# EAGLE design stair light usb (EAGLE 6.2)
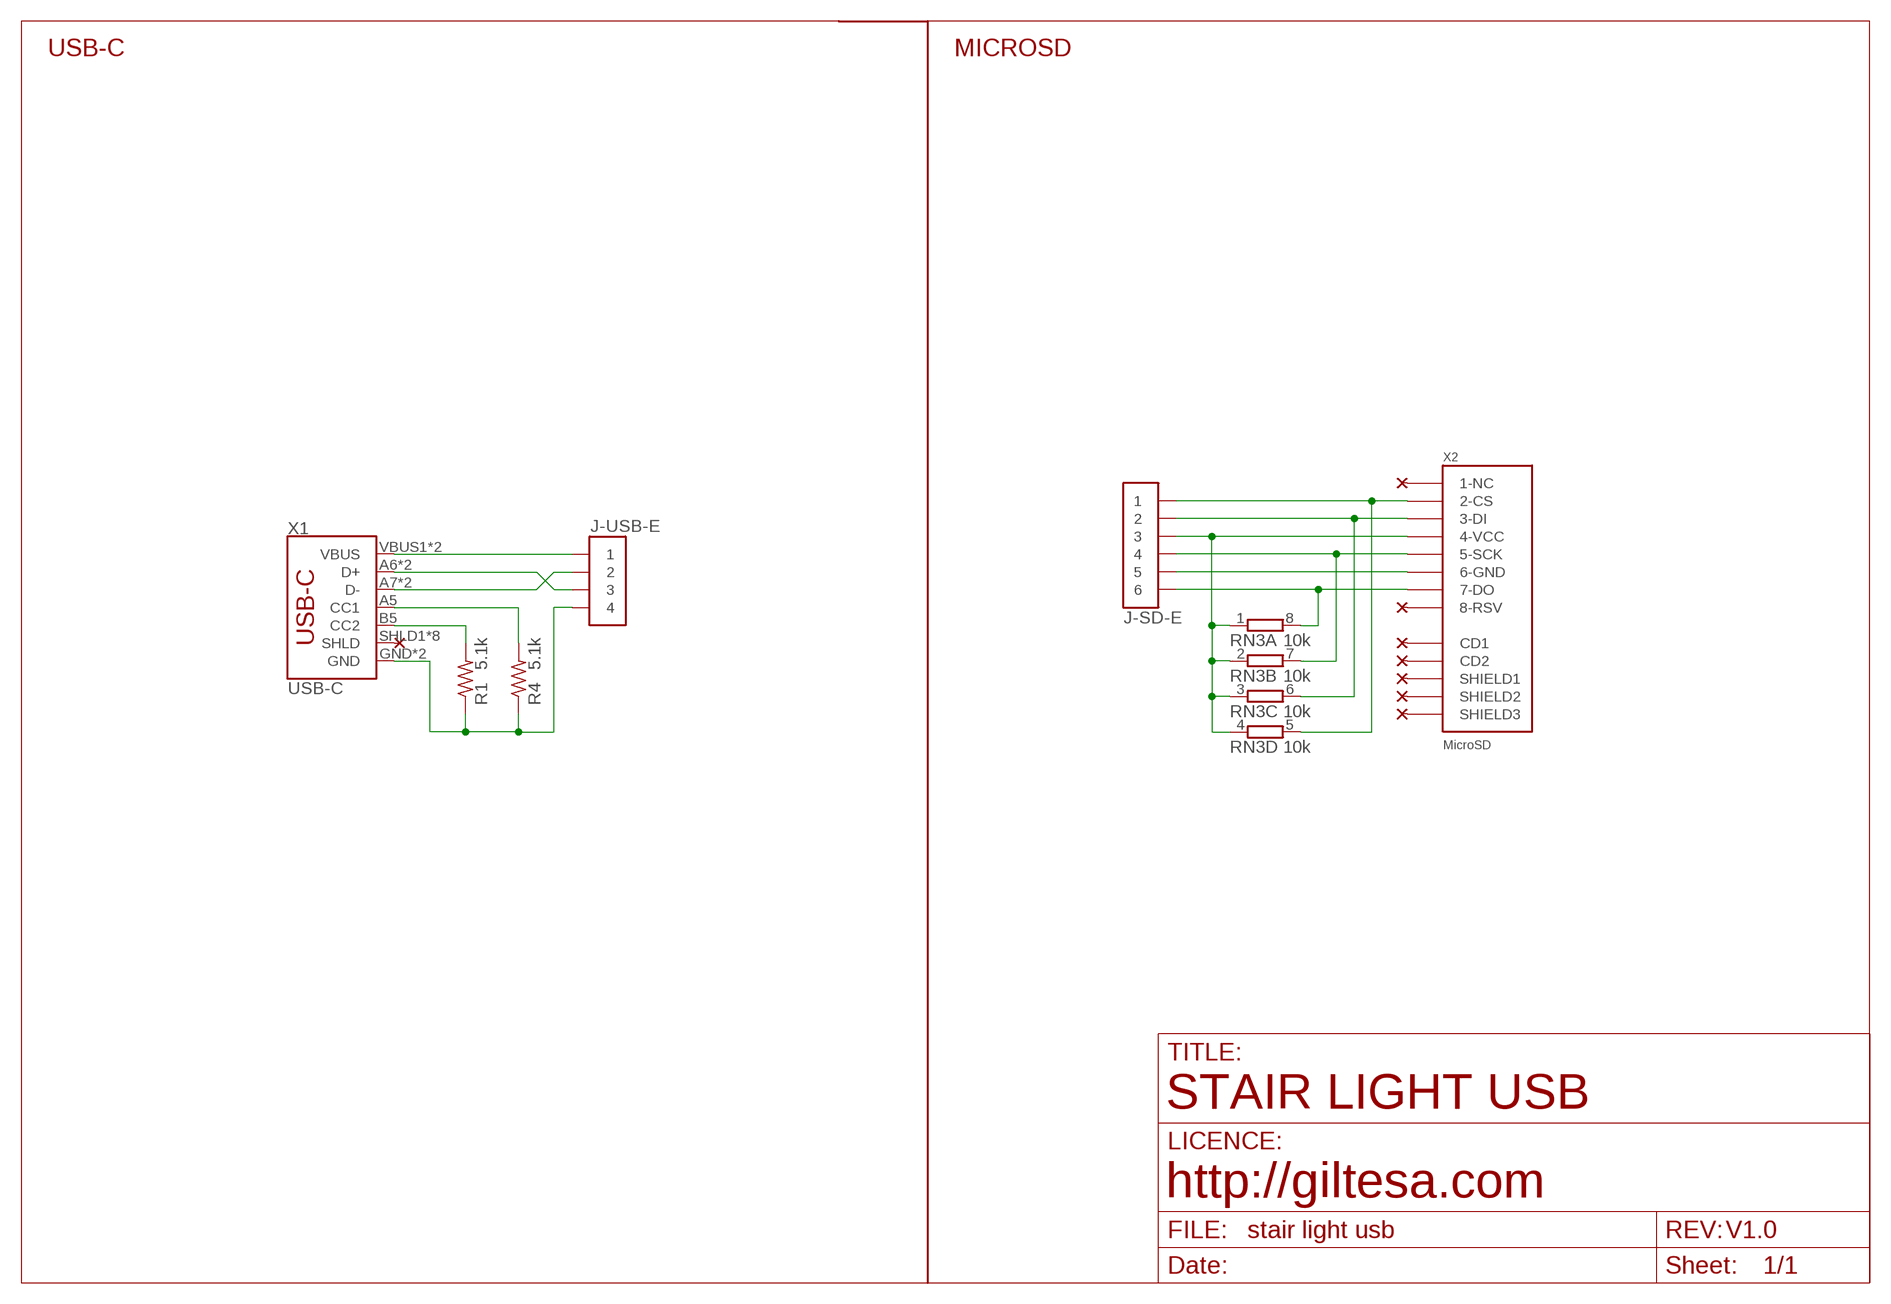
[diagram p0: schematic, sheet 1]

## Parts
J-SD-E  2X03  [2X03]
J-USB-E  2X02  [2X02]
R1  5.1k  R0603  [R0603]
R4  5.1k  R0603  [R0603]
RN3  10k  4R-N0603-ARV  [0603-ARV]
X1  USB-C  USB_C16PIN  [USB-C-16P]
X2  MicroSD  MICROSD_2  [MICROSD_2]

## Nets
EXT_PCB_3.3V: J-SD-E.3 RN3.1 RN3.2 RN3.3 RN3.4 X2.4-VCC
EXT_PCB_5V: J-USB-E.1 X1.VBUS1(VBUS) X1.VBUS2(VBUS)
EXT_PCB_CC1: R4.2 X1.A5(CC1)
EXT_PCB_CC2: R1.2 X1.B5(CC2)
EXT_PCB_D+: J-USB-E.3 X1.A6(D+) X1.B6(D+)
EXT_PCB_D-: J-USB-E.2 X1.A7(D-) X1.B7(D-)
EXT_PCB_GND: J-SD-E.5 J-USB-E.4 R1.1 R4.1 X1.GND X1.GND2(GND) X2.6-GND
EXT_PCB_MISO: J-SD-E.6 RN3.8 X2.7-DO
EXT_PCB_MOSI: J-SD-E.2 RN3.6 X2.3-DI
EXT_PCB_SCK: J-SD-E.4 RN3.7 X2.5-SCK
EXT_PCB_SD_CS: J-SD-E.1 RN3.5 X2.2-CS
Unconnected: X1.SHLD1(SHLD) X1.SHLD2(SHLD) X1.SHLD3(SHLD) X1.SHLD4(SHLD) X1.SHLD5(SHLD) X1.SHLD6(SHLD) X1.SHLD7(SHLD) X1.SHLD8(SHLD) X2.1-NC X2.8-RSV X2.CD1 X2.CD2 X2.SHIELD1 X2.SHIELD2 X2.SHIELD3

## Notes on the sheet
- USB-C | MICROSD
- STAIR LIGHT USB
- http://giltesa.com
- V1.0

## Library data of the parts
J-SD-E = ,giltesa:2X03
J-USB-E = ,giltesa:2X02
R1 R4 = ,giltesa:R0603
RN3 = resistor-dil:4R-N: Array Chip Resistor Source: RS Component / Phycomp; OC_FARNELL: unknown; OC_NEWARK: unknown
X1 = SparkFun-Connectors:USB_C: USB Type C 16Pin Connector Super Speed pins not available on the 16-pin purely SMD connector so this part is best for USB 2.0 implementations. D1 and D2 are tied together enabling D+/- no matter which way the cable is plugged into the connector. The two channel configuration pins (CC1/2) are exposed. These are normally connected to ground via 5.1k resistors but can be reconfigured for high current/high power applications.; PROD_ID: CONN-14122
X2 = ,giltesa:MICROSD_2

## Net classes
1 power: width 0.178 mm
2 gnd: width 0.305 mm, drill 0.406 mm, clearance 0.203 mm
3 power usb: width 0.508 mm, drill 0.406 mm, clearance 0.203 mm
4 aref: width 0.254 mm, drill 0.61 mm, clearance 0.254 mm

## Board
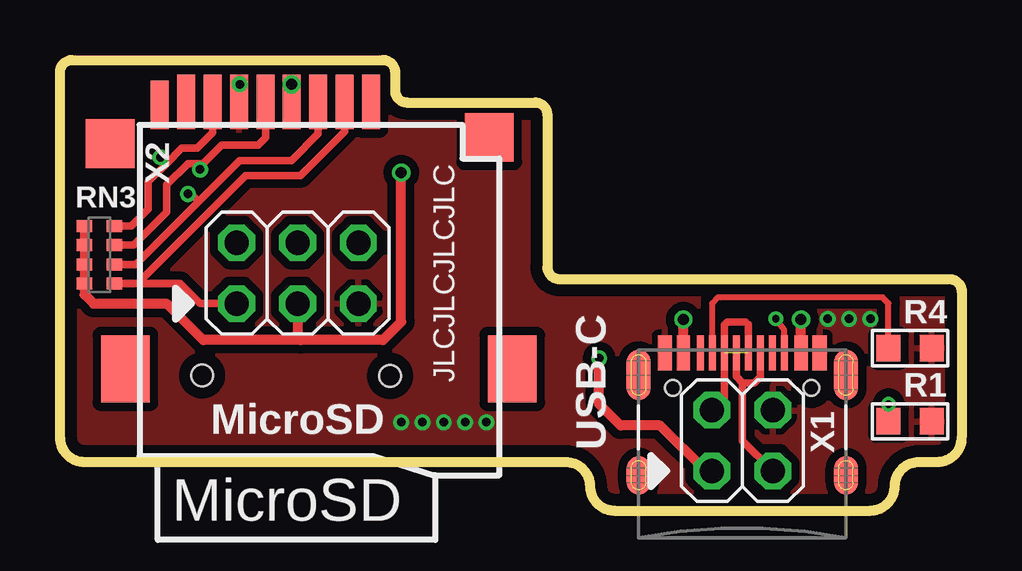
[diagram p1: board, top side]
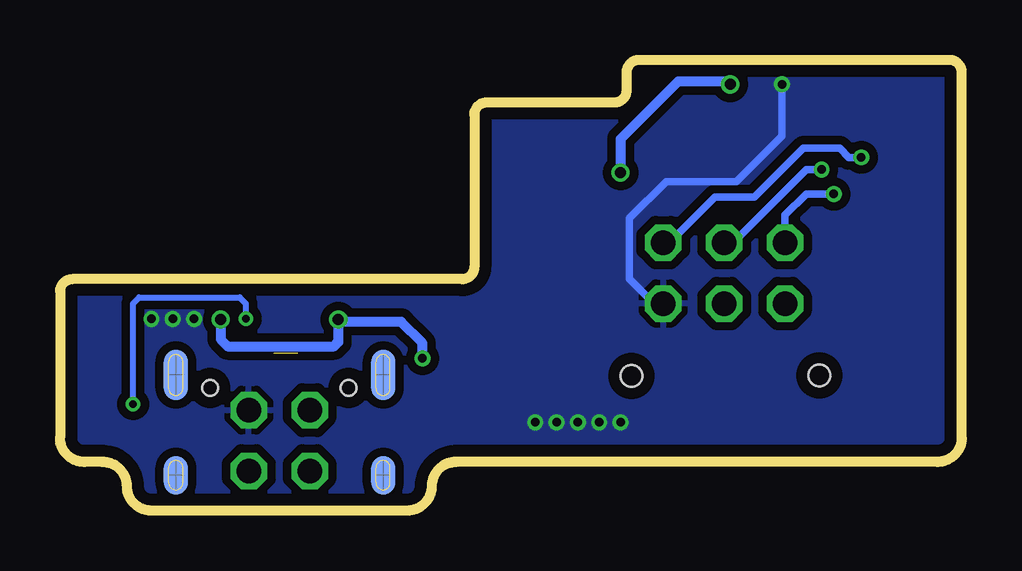
[diagram p2: board, bottom side, seen from below]

Size 37.59 x 18.8 mm. Coordinates in mm from the lower left corner, seen from the top.
Outline: 0,3.05 arc90 1.02,2.03 21.08,2.03 arc-90 22.1,1.02 arc90 23.11,0 33.78,0 arc90 34.8,1.02 arc-90 35.81,2.03 36.58,2.03 arc90 37.59,3.05 37.59,9.14 arc90 37.08,9.65 20.83,9.65 arc-90 20.32,10.16 20.32,16.51 arc90 19.81,17.02 14.48,17.02 arc-90 13.97,17.53 13.97,18.29 arc90 13.46,18.8 0.51,18.8 arc90 0,18.29 0,3.05
Copper layers (1*16): Top 0.035mm / dielectric 1.6mm / Bottom 0.035mm
Design rules: minimum track width 6mil, minimum drill 12mil, track to track 6mil, track to pad 6mil, pad to pad 6mil, via to via 8mil, smd to smd 0mil, copper to edge 20mil, drill to drill 10mil, minimum pad ring 6mil, minimum via ring 6mil, stop-mask expansion 0mil, vias tented up to drill 100mil, thermal gap 10mil

### Footprints (pad centres in the part's own frame; a part is rotated, then mirrored left to right if it is on the bottom)
2X03 = drill 1.016 octagon: 1 -2.54,-1.27; 2 -2.54,1.27; 3 0,-1.27; 4 0,1.27; 5 2.54,-1.27; 6 2.54,1.27
2X02 = drill 1.016 octagon: 1 -1.27,-1.27; 2 -1.27,1.27; 3 1.27,-1.27; 4 1.27,1.27
R0603 = smd 1 x 1.1: 1 -0.901,0; 2 0.901,0
0603-ARV = smd 0.5 x 0.65: 1 -1.2,-0.625; 2 -0.4,-0.625; 3 0.4,-0.625; 4 1.2,-0.625; 5 1.2,0.625; 6 0.4,0.625; 7 -0.4,0.625; 8 -1.2,0.625
USB-C-16P = smd 0.3 x 1.45: A5 -1.25,0; A6 -0.25,0; A7 0.25,0; A8 1.25,0; B5 1.75,0; B6 0.75,0; B7 -0.75,0; B8 -1.75,0 | smd 0.6 x 1.45: GND -3.225,0; GND2 3.225,0 | smd 1 x 2.1: SHLD1 -4.32,-0.915; SHLD2 4.32,-0.915 | smd 1 x 2.1 bottom: SHLD3 -4.32,-0.915; SHLD4 4.32,-0.915 | smd 1 x 1.6: SHLD5 -4.32,-5.095; SHLD8 4.32,-5.095 | smd 1 x 1.6 bottom: SHLD6 -4.32,-5.095; SHLD7 4.32,-5.095 | smd 0.55 x 1.45: VBUS1 -2.45,0; VBUS2 2.45,0 | hole 0.65: -2.89,-1.445; 2.89,-1.445
MICROSD_2 = smd 2.286 x 0.75: 1-NC -0.963,9.652; 2-CS -0.963,8.552; 3-DI -0.963,7.452; 4-VCC -0.963,6.352; 5-SCK -0.963,5.252; 6-GND -0.963,4.152; 7-DO -0.963,3.052; 8-RSV -0.963,1.952 | smd 2.033 x 0.75: CD1 -0.836,0.852 | smd 2.032 x 2.032: CD2 0.773,-1.22; SHIELD1 0.519,14.578 | smd 2.794 x 2.032: SHIELD2 10.171,15.544; SHIELD3 10.171,-0.585 | hole 0.9: 10.45,2.62; 10.46,10.45

### Placement (x,y rotation side)
J-SD-E  9.91,9.91 0 top
J-USB-E  28.45,2.92 0 top
R1  35.43,3.73 180 top
R4  35.43,6.78 180 top
RN3  1.65,10.67 270 top
X1  28.44,6.57 0 top
X2  3.31,16.08 270 top

### Tracks (layer width: path | path; a pad name or v marks a point on that pad's centre or on a via)
EXT_PCB_3.3V  (via drill 0.46)
  Top 0.406: RN3.1 RN3.2 RN3.3 RN3.4 1.03,9.01 1.4,8.64 4.45,8.64 5.97,7.11 10.03,7.11 | v9.65,17.78 9.65,17.06 X2.4-VCC | 10.03,7.11 13.46,7.11 14.22,7.87 v14.22,14.1 | J-SD-E.3 9.91,7.24 10.03,7.11
  Bottom 0.406: v9.65,17.78 9.78,17.91 11.81,17.91 14.22,15.49 v14.22,14.1
EXT_PCB_5V  (via drill 0.36, 0.46)
  Top 0.406: X1.VBUS2 v30.89,7.97 | X1.VBUS1 v25.99,7.97 | J-USB-E.1 26.92,1.65 25.02,3.56 23.37,3.56 22.48,4.45 v22.48,6.35
  Bottom 0.406: v30.89,7.97 30.89,7.14 30.61,6.86 26.16,6.86 25.99,7.03 v25.99,7.97 25.9,7.87 23.37,7.87 22.48,6.98 v22.48,6.35
EXT_PCB_CC1
  Top 0.254: R4.2 34.53,8.65 34.29,8.89 27.43,8.89 27.19,8.65 X1.A5
EXT_PCB_CC2  (via drill 0.3)
  Top 0.254: R1.2 34.53,4.31 | 34.53,4.31 34.54,4.32 | 34.53,4.31 34.53,4.43 v34.54,4.45 | X1.B5 30.19,7.53 v29.84,8
  Bottom 0.254: v34.54,4.45 34.54,8.64 34.29,8.89 30.1,8.89 29.84,8.64 v29.84,8
EXT_PCB_D+
  Top 0.305: X1.B6 29.19,5.57 28.96,5.33 28.45,5.33 | 28.45,5.33 28.19,5.59 28.19,6.6 | J-USB-E.3 28.45,2.92 28.45,5.33
EXT_PCB_D-  (1 unrouted)
  Top 0.305: X1.A7 28.69,7.76 28.57,7.87 27.81,7.87 27.69,7.75 27.69,4.71 J-USB-E.2
EXT_PCB_GND  (via drill 0.36)
  Top 0.305: v7.49,17.78 7.49,17.07 X2.6-GND
  Bottom 0.305: J-SD-E.5 12.83,8.64 13.84,9.65 13.84,12.19 12.32,13.72 9.4,13.72 7.49,15.62 v7.49,17.78
  other vias: 14.22,3.68 32,8 32.89,8 33.78,8 15.11,3.68 16,3.68 16.89,3.68 17.78,3.68
  pour Top (isolate 0.356): -1.52,20.07 39.12,20.07 39.12,-1.52 -1.52,-1.52
  pour Bottom (isolate 0.356): -0.89,19.43 38.48,19.43 38.48,-0.89 -0.89,-0.89
EXT_PCB_MISO  (via drill 0.36)
  Top 0.305: RN3.8 2.98,11.87 3.68,12.57 3.68,13.72 4.45,14.48 | X2.7-DO 6.37,15.76 5.71,15.11 5.08,15.11 4.45,14.48 | v4.19,14.73 4.45,14.48
  Bottom 0.305: J-SD-E.6 12.19,11.18 10.29,13.08 8.64,13.08 6.6,15.11 5.08,15.11 4.7,14.73 v4.19,14.73
EXT_PCB_MOSI  (via drill 0.36)
  Top 0.305: X2.3-DI 10.77,15.72 9.65,14.61 7.49,14.61 5.78,12.89 | RN3.6 3.16,10.27 5.78,12.89 | v5.33,13.21 5.46,13.21 5.78,12.89
  Bottom 0.305: v5.33,13.21 6.48,13.21 7.37,12.32 J-SD-E.2
EXT_PCB_SCK  (via drill 0.36)
  Top 0.305: X2.5-SCK 8.57,15.55 8.26,15.24 6.73,15.24 5.97,14.48 5.84,14.48 | RN3.7 3.07,11.07 4.45,12.45 4.45,13.59 5.33,14.48 5.84,14.48 | v5.84,14.22 5.84,14.48
  Bottom 0.305: J-SD-E.4 9.53,11.18 6.48,14.22 v5.84,14.22
EXT_PCB_SD_CS
  Top 0.305: X2.2-CS 11.87,15.8 10.03,13.97 7.75,13.97 3.25,9.47 | J-SD-E.1 5.84,8.64 5.01,9.47 3.25,9.47 | RN3.5 3.25,9.47

### Text on the board
tPlace: JLCJLCJLCJLC